# EAGLE design Power.Board (EAGLE 6.6.0)
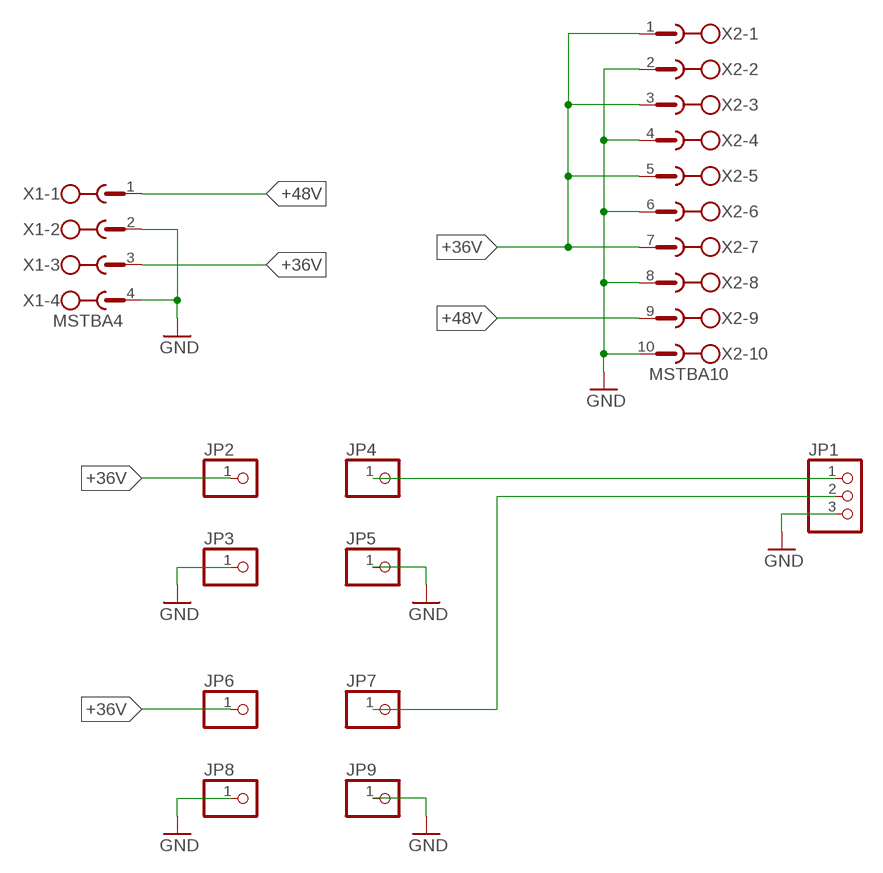
[diagram p0: schematic, sheet 1]

## Parts
JP1  PINHD-1X3/90  [1X03/90]
JP2  PINHD-1X1  [1X01]
JP3  PINHD-1X1  [1X01]
JP4  PINHD-1X1  [1X01]
JP5  PINHD-1X1  [1X01]
JP6  PINHD-1X1  [1X01]
JP7  PINHD-1X1  [1X01]
JP8  PINHD-1X1  [1X01]
JP9  PINHD-1X1  [1X01]
X1  MSTBA4  [MSTBA4]
X2  MSTBA10  [MSTBA10]

## Nets
+36V: JP2.1 JP6.1 X1.3 X2.1 X2.3 X2.5 X2.7
+48V: X1.1 X2.9
GND: JP1.3 JP3.1 JP5.1 JP8.1 JP9.1 X1.2 X1.4 X2.2 X2.4 X2.6 X2.8 X2.10
N$4: JP1.1 JP4.1
N$5: JP1.2 JP7.1

## Library data of the parts
JP1 = pinhead:PINHD-1X3: PIN HEADER
JP2-JP9 = pinhead:PINHD-1X1: PIN HEADER
X1 = con-phoenix-508:MSTBA4: PHOENIX
X2 = con-phoenix-508:MSTBA10: PHOENIX

## Board
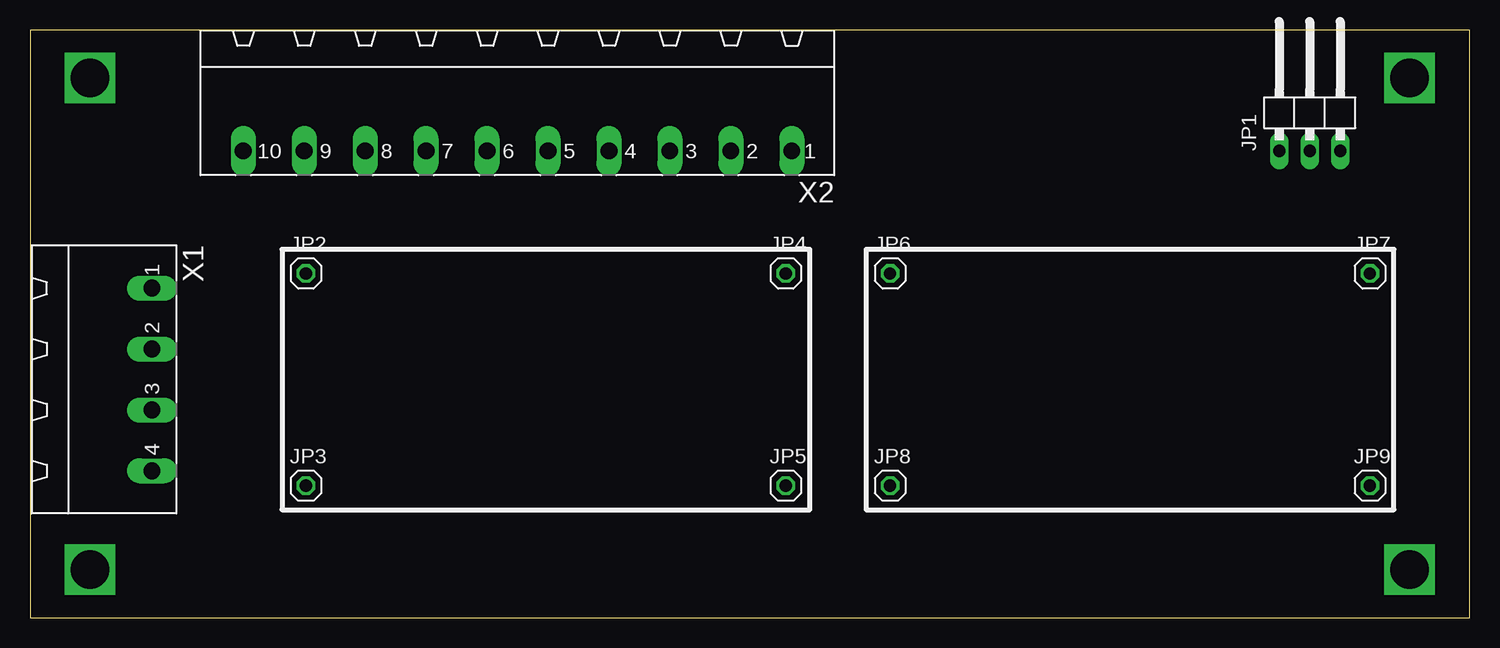
[diagram p1: board, top side]
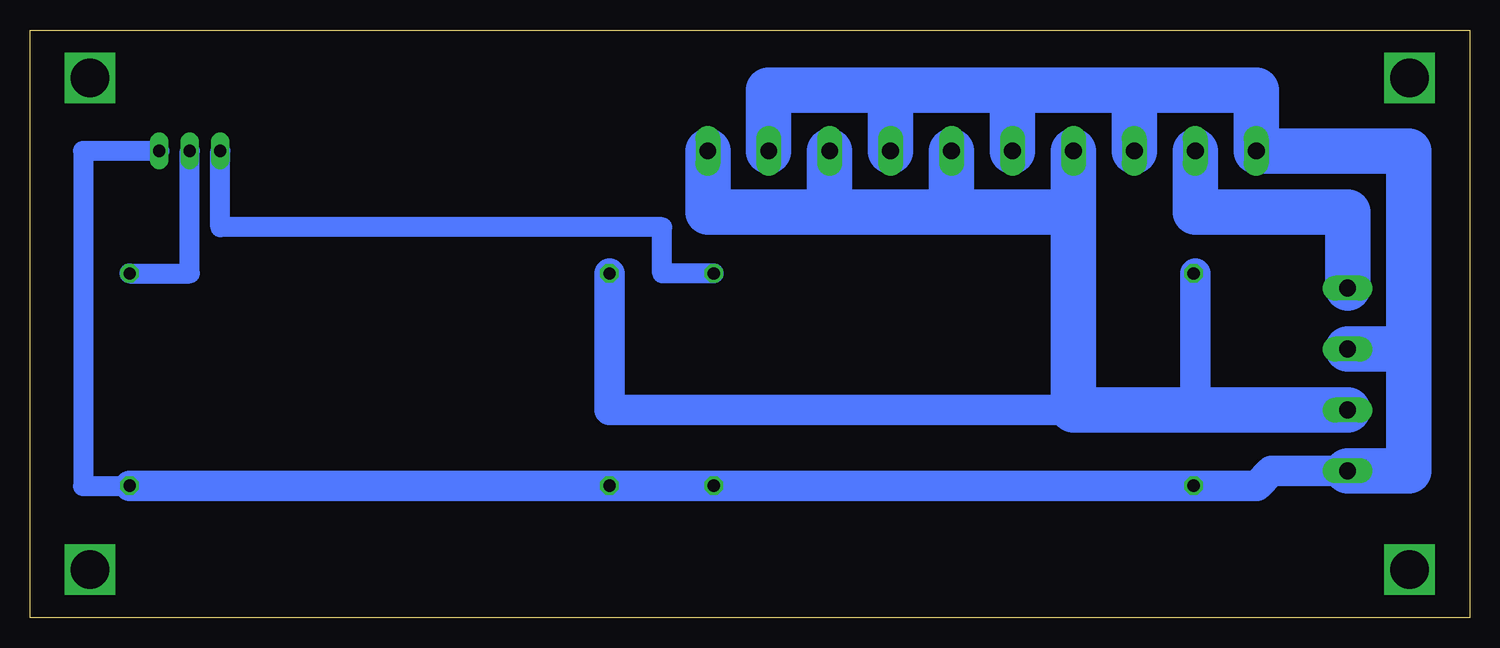
[diagram p2: board, bottom side, seen from below]

Size 120 x 49 mm. Coordinates in mm from the lower left corner, seen from the top.
Outline: 0,0 120,0 120,49 0,49 0,0
Copper layers (1*16): Top 0.035mm / dielectric 1.5mm / Bottom 0.035mm
Design rules "default": minimum track width 10mil, minimum drill 24mil, track to track 8mil, track to pad 8mil, pad to pad 8mil, via to via 8mil, smd to smd 8mil, copper to edge 40mil, drill to drill 8mil, minimum pad ring 10mil, minimum via ring 8mil, stop-mask expansion 4mil, vias tented up to drill 0mil, thermal gap 10mil

### Footprints (pad centres in the part's own frame; a part is rotated, then mirrored left to right if it is on the bottom)
1X03/90 = drill 1.016 long: 1 -2.54,-3.81; 2 0,-3.81; 3 2.54,-3.81
1X01 = drill 1.016 octagon: 1 0,0
MSTBA4 = drill 1.397 long: 1 -7.62,5.08; 2 -2.54,5.08; 3 2.54,5.08; 4 7.62,5.08
MSTBA10 = drill 1.397 long: 1 -22.86,5.08; 2 -17.78,5.08; 3 -12.7,5.08; 4 -7.62,5.08; 5 -2.54,5.08; 6 2.54,5.08; 7 7.62,5.08; 8 12.7,5.08; 9 17.78,5.08; 10 22.86,5.08

### Placement (x,y rotation side)
JP1  106.68,42.72 0 top
JP2  23,28.7 0 top
JP3  23,11 0 top
JP4  63,28.7 0 top
JP5  63,11 0 top
JP6  71.7,28.7 0 top
JP7  111.7,28.7 0 top
JP8  71.7,11 0 top
JP9  111.7,11 0 top
X1  5.08,19.85 270 top
X2  40.64,43.99 180 top

### Tracks (layer width: path | path; a pad name or v marks a point on that pad's centre or on a via)
+36V
  Bottom 1.27: 33.02,28.7 33.02,28.75 | JP2.1 22.86,28.7
  Bottom 2.54: X2.7 33.02,33.83 | JP6.1 71.7,17.31 33.02,17.31 | 22.86,28.7 22.86,17.31
  Bottom 3.81: 33.02,33.83 43.18,33.83 | X2.5 43.18,33.83 | 43.18,33.83 53.34,33.83 | X2.3 53.34,33.83 | 53.34,33.83 63.5,33.83 X2.1 | X1.3 22.86,17.31 33.02,17.31 33.02,28.75 X2.7
+48V
  Bottom 3.81: X1.1 10.16,33.83 22.86,33.83 X2.9
GND
  Bottom 1.27: X1.4 | 111.7,10.97 JP9.1
  Bottom 1.676: JP1.3 115.57,38.91 115.57,10.97 111.7,10.97
  Bottom 2.54: X1.2 | JP9.1 JP8.1 JP5.1 JP3.1 17.75,11 16.51,12.24 X1.4
  Bottom 3.81: 27.94,43.99 17.78,43.99 X2.10 5.08,38.91 5.08,22.4 | X2.8 27.94,43.99 | 27.94,43.99 38.1,43.99 | X2.2 58.42,43.99 48.26,43.99 | X2.4 48.26,43.99 | 48.26,43.99 38.1,43.99 | 38.1,43.99 X2.6 | X1.4 5.08,12.23 5.08,22.4 | 5.08,22.4 X1.2
N$1  (via drill 3.2)
  other vias: 5,45
N$2  (via drill 3.2)
  other vias: 5,4 115,4 115,45
N$4
  Bottom 1.676: JP4.1 67.31,28.7 67.31,32.56 104.14,32.56 JP1.1
N$5
  Bottom 1.676: JP7.1 106.68,28.7 JP1.2